# Altium schematic sheet Power_CAN_IO_GPS.SchDoc
size A2
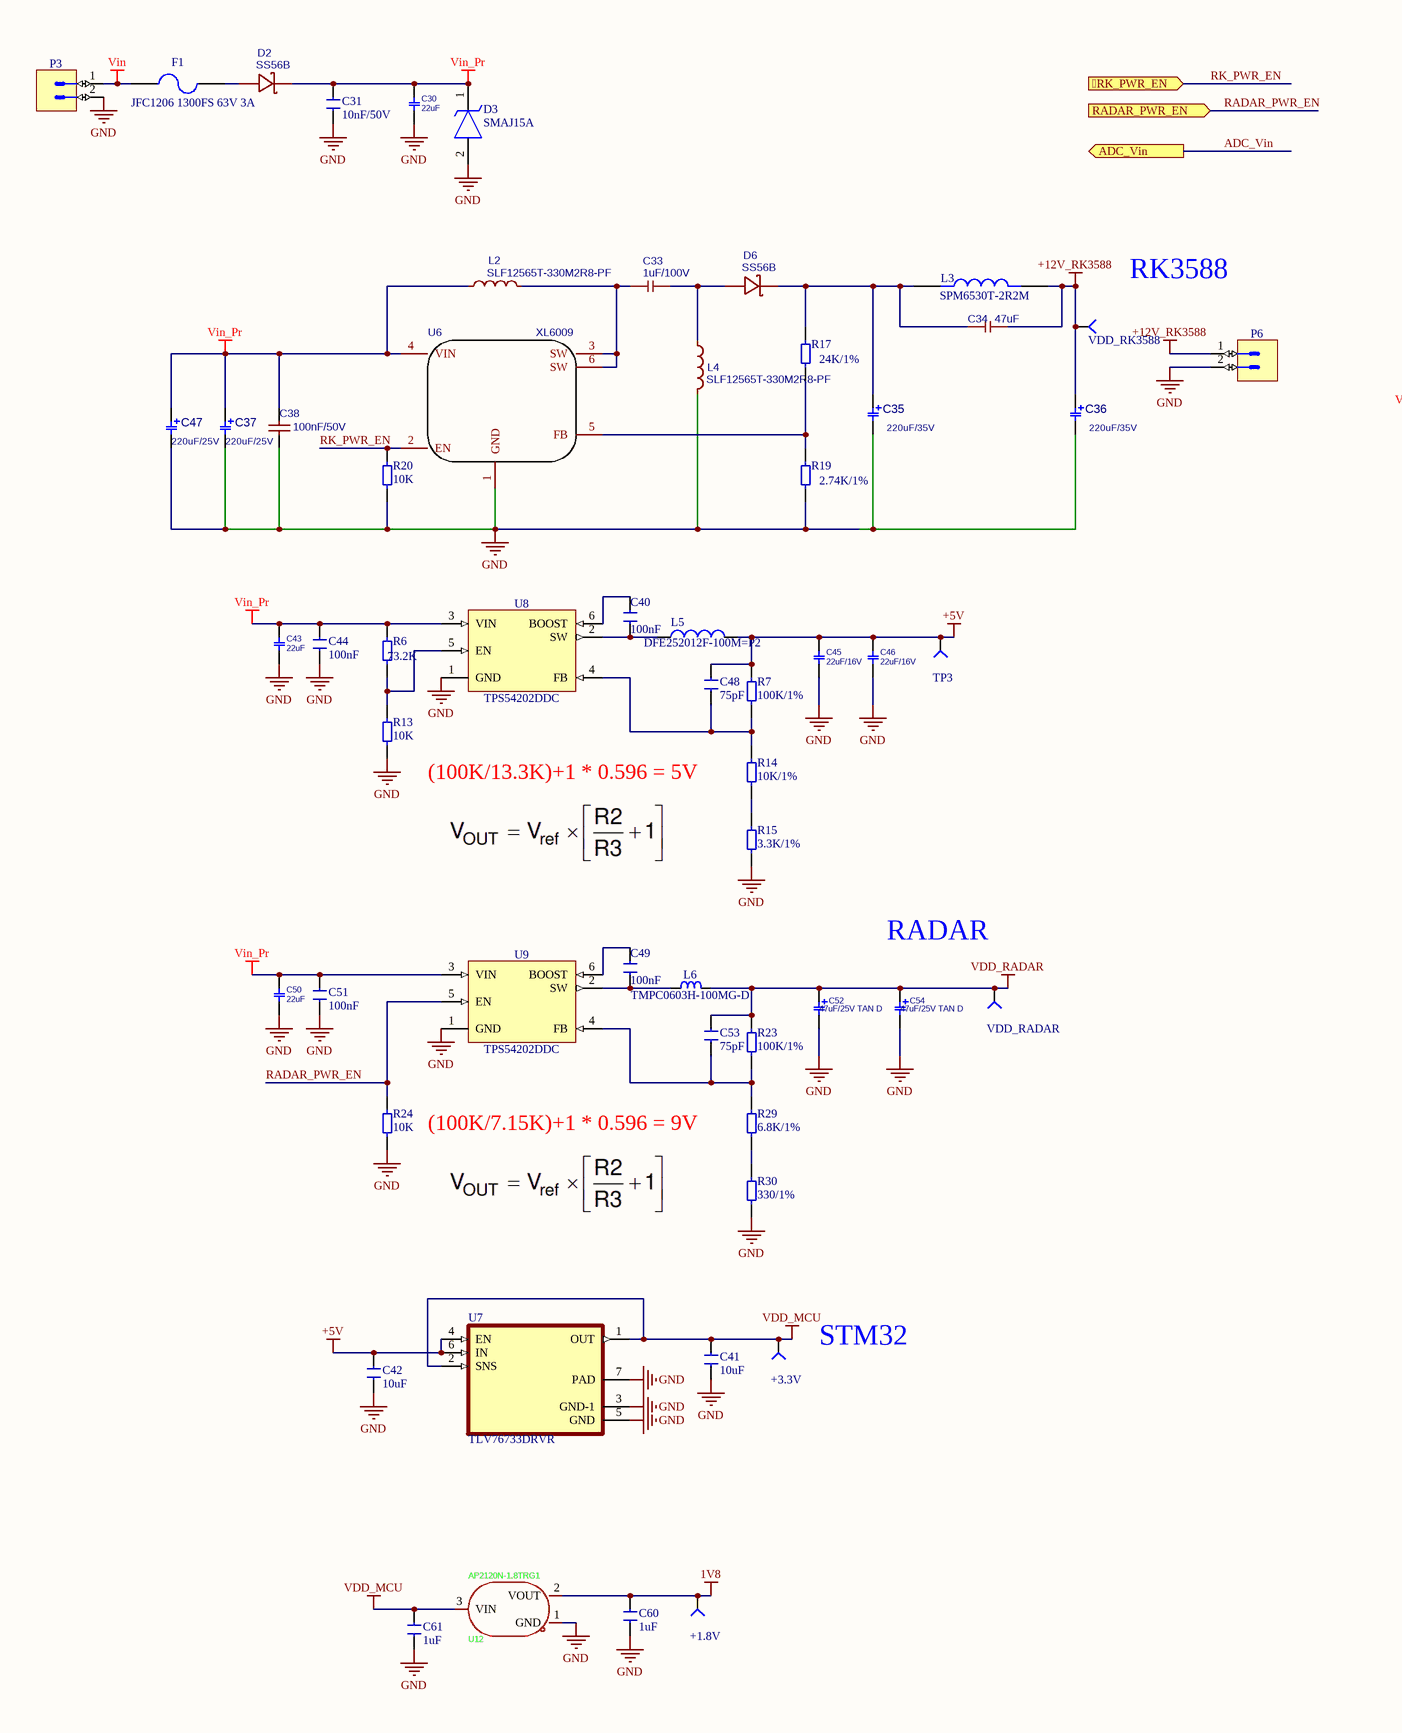
[diagram p0: Power_CAN_IO_GPS.SchDoc, left]
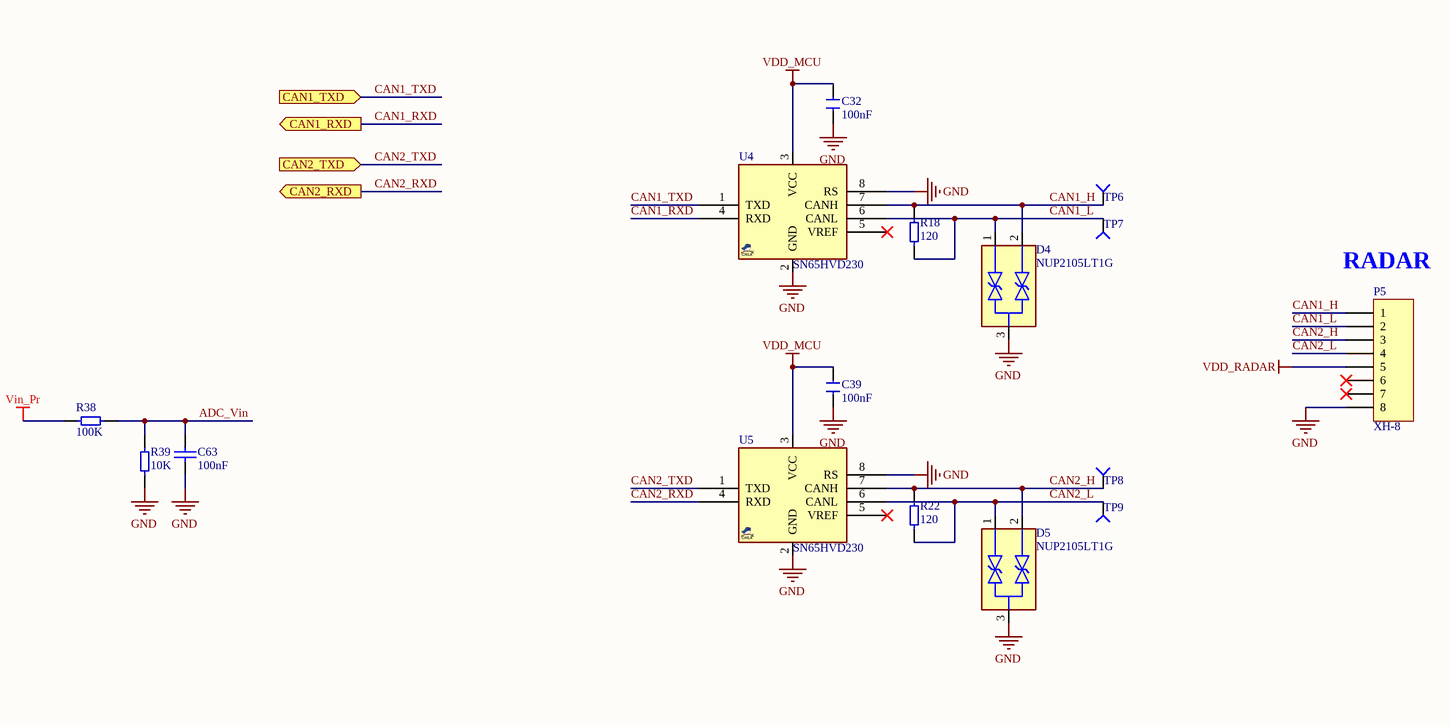
[diagram p1: Power_CAN_IO_GPS.SchDoc, right]

## Parts
+1.8V  TEST POINT  [TEST_POINT]  (value not drawn)  (no BOM)
+3.3V  TEST POINT  [TEST_POINT]  (value not drawn)  (no BOM)
C30  22uF  [C1206E]
C31  10nF/50V  [C0603E]
C32  100nF  [C0603E]
C33  1uF/100V  [C1210]
C34  47uF  [C1210]
C35  220uF/35V  [C_EL_D8L10]
C36  220uF/35V  [C_EL_D8L10]
C37  220uF/25V  [C_EL_D8L10]
C38  100nF/50V  [C0805]
C39  100nF  [C0603E]
C40  100nF  [C0603E]
C41  10uF  [C0603E]
C42  10uF  [C0603E]
C43  22uF  [C1206E]
C44  100nF  [C0603E]
C45  22uF/16V  [C1206E]
C46  22uF/16V  [C1206E]
C47  220uF/25V  [C_EL_D8L10]
C48  75pF  [C0603E]
C49  100nF  [C0603E]
C50  22uF  [C1206E]
C51  100nF  [C0603E]
C52  47uF/25V TAN D  [C_TN_7343]
C53  75pF  [C0603E]
C54  47uF/25V TAN D  [C_TN_7343]
C60  1uF  [C0603E]
C61  1uF  [C0603E]
C63  100nF  [C0603]
D2  SS56B  [SMB_L4.6-W3.6-LS5.3-RD]
D3  SMAJ15A  [DIOM5026X229N]
D4  NUP2105LT1G  [SOT95P237X111-3N]
D5  NUP2105LT1G  [SOT95P237X111-3N]
D6  SS56B  [SMB_L4.6-W3.6-LS5.3-RD]
F1  JFC1206 1300FS 63V 3A  [1206 FUSE]
L2  SLF12565T-330M2R8-PF  [IND-SMD_L12.3-W12.3]
L3  SPM6530T-2R2M  [IND_SPM6530T-2R2M-HZ]
L4  SLF12565T-330M2R8-PF  [IND-SMD_L12.3-W12.3]
L5  DFE252012F-100M=P2  [INDC2520X120N]
L6  TMPC0603H-100MG-D  [IND-SMD_L7.3-W6.6]
P3  KF2EDGV+K-3.81-2P  [PHOENIX_1803426]  (value not drawn)
P5  XH-8  [HDR1X8]
P6  KF2EDGV+K-3.81-2P  [PHOENIX_1803426]  (value not drawn)
R6  73.2K  [R0603E]
R7  100K/1%  [R0603E]
R13  10K  [R0603E]
R14  10K/1%  [R0603E]
R15  3.3K/1%  [R0603E]
R17  24K/1%  [R0603E]
R18  120  [R0603E]
R19  2.74K/1%  [R0603E]
R20  10K  [R0603E]
R22  120  [R0603E]
R23  100K/1%  [R0603E]
R24  10K  [R0603E]
R29  6.8K/1%  [R0603E]
R30  330/1%  [R0603E]
R38  100K  [R0603]
R39  10K  [R0603]
TP3  TEST POINT  [TEST_POINT]  (value not drawn)  (no BOM)
TP6  TEST POINT  [TEST_POINT]  (value not drawn)  (no BOM)
TP7  TEST POINT  [TEST_POINT]  (value not drawn)  (no BOM)
TP8  TEST POINT  [TEST_POINT]  (value not drawn)  (no BOM)
TP9  TEST POINT  [TEST_POINT]  (value not drawn)  (no BOM)
U4  SN65HVD230  [SO_8]
U5  SN65HVD230  [SO_8]
U6  XL6009  [TO-263-5]
U7  TLV76733DRVR  [SON65P200X200X80-7N]
U8  TPS54202DDC  [SOT95P280X100-6N]
U9  TPS54202DDC  [SOT95P280X100-6N]
U12  AP2120N-1.8TRG1  [SOT-23-3_L2.9-W1.3-P1.90-LS2.4-BR]
VDD_RADAR  TEST POINT  [TEST_POINT]  (value not drawn)  (no BOM)
VDD_RK3588  TEST POINT  [TEST_POINT]  (value not drawn)  (no BOM)

## Ports
RK_PWR_EN (in), ADC_Vin (out), CAN1_RXD (out), CAN1_TXD (in), CAN2_RXD (out), CAN2_TXD (in), RADAR_PWR_EN (in)

## Nets
1V8: +1.8V.1(TP) C60.2 U12.2(VOUT)
+5V: C42.2 C45.2 C46.2 C48.2 L5.2 R7.1 TP3.1(TP) U7.4(EN) U7.6(IN)
+12V_RK3588: C34.2 C36.1 L3.2 P6.1 VDD_RK3588.1(TP)
GND: C30.1 C31.1 C32.1 C35.2 C36.2 C37.2 C38.1 C39.1 C41.1 C42.1 C43.1 C44.1 C45.1 C46.1 C47.2 C50.1 C51.1 C52.2 C54.2 C60.1 C61.1 C63.1 D3.2(A) D4.3 D5.3 L4.2 P3.2 P5.8 P6.2 R13.2 R15.2 R19.2 R20.2 R24.2 R30.2 R39.1 U4.2(GND) U4.8(RS) U5.2(GND) U5.8(RS) U6.1(GND) U7.3(GND-1) U7.5(GND) U7.7(PAD) U8.1(GND) U9.1(GND) U12.1(GND)
VDD_MCU: +3.3V.1(TP) C32.2 C39.2 C41.2 C61.2 U4.3(VCC) U5.3(VCC) U7.1(OUT) U7.2(SNS) U12.3(VIN)
VDD_RADAR: C52.1 C53.2 C54.1 L6.2 P5.5 R23.1 VDD_RADAR.1(TP)
Vin: F1.1 P3.1
Vin_Pr: C30.2 C31.2 C37.1 C38.2 C43.2 C44.2 C47.1 C50.2 C51.2 D2.1(K) D3.1(K) L2.1 R6.1 R38.1 U6.4(VIN) U8.3(VIN) U9.3(VIN)
ADC_Vin: C63.2 R38.2 R39.2 ; port ADC_Vin
CAN1_H: D4.2 P5.1 R18.2 TP6.1(TP) U4.7(CANH)
CAN1_L: D4.1 P5.2 R18.1 TP7.1(TP) U4.6(CANL)
CAN1_RXD: U4.4(RXD) ; port CAN1_RXD
CAN1_TXD: U4.1(TXD) ; port CAN1_TXD
CAN2_H: D5.2 P5.3 R22.2 TP8.1(TP) U5.7(CANH)
CAN2_L: D5.1 P5.4 R22.1 TP9.1(TP) U5.6(CANL)
CAN2_RXD: U5.4(RXD) ; port CAN2_RXD
CAN2_TXD: U5.1(TXD) ; port CAN2_TXD
RADAR_PWR_EN: R24.1 U9.5(EN) ; port RADAR_PWR_EN
RK_PWR_EN: R20.1 U6.2(EN) ; port RK_PWR_EN
NetC33_1: C33.1 L2.2 U6.3(SW) U6.6(SW)
NetC33_2: C33.2 D6.2(A) L4.1
NetC34_1: C34.1 C35.1 D6.1(K) L3.1 R17.1
NetC40_1: C40.1 U8.6(BOOST)
NetC40_2: C40.2 L5.1 U8.2(SW)
NetC48_1: C48.1 R7.2 R14.1 U8.4(FB)
NetC49_1: C49.1 U9.6(BOOST)
NetC49_2: C49.2 L6.1 U9.2(SW)
NetC53_1: C53.1 R23.2 R29.1 U9.4(FB)
NetD2_2: D2.2(A) F1.2
NetR6_2: R6.2 R13.1 U8.5(EN)
NetR14_2: R14.2 R15.1
NetR17_2: R17.2 R19.1 U6.5(FB)
NetR29_2: R29.2 R30.1

Not connected (* = marked no-connect by the designer): P5 6* 7*; U4 5(VREF)*; U5 5(VREF)*

## Notes on the sheet
- RK3588
- (near P5) RADAR
- (100K/13.3K)+1 * 0.596 = 5V
- RADAR
- (100K/7.15K)+1 * 0.596 = 9V
- (near +3.3V) STM32

## Library data of the parts
+1.8V +3.3V TP3 TP6-TP9 VDD_RADAR VDD_RK3588 = TEST POINT: Board Qty: 100; PCB Name: Main_PCB
C30 C43 C45 C46 C50 = CAP_SMD_MLCC_22u25V: CAP, MLCC, X5R 22uF 25V 20% 1206; PARAM: X5R, 20%; MANF_P#: TMK316BBJ226ML-T; MANF: Taiyo Yuden; DESC: CAP, MLCC, 22uF, 25V, X5R,  20%, 1206; PARAM2: 25V; PRICE: 0.572$
  C30 C43 C50: VALUE: 22uF
  C45 C46: VALUE: 22uF/16V
C31 C32 C39-C42 C44 C48 C49 C51 C53 C60 C61 = Capacitor SMD
  C31: Value: 10nF/50V
  C32 C39 C40 C44 C49 C51: Value: 100nF
  C41 C42: Value: 10uF
  C48 C53: Value: 75pF
  C60 C61: Value: 1uF
C33 C34 = 47uF: Manufacturer Part: GRM32ER71A476ME15L; catid: 20; spicePre: C
C35 C36 = CAP_SMD_EL_220uF_35v: CAP, SMD, ELEC,; MANF_P#: MANF_PART#; DESC: DESCRIPTION; DIST#: MOUSER; PARAM: 20%; PARAM2: 35v; VALUE: 220uF; PRICE: 10= -$; MANF: MANF; ASSEMBLY: ASSEMBLY
C37 C47 = CAP_SMD_EL_220uF_35v: CAP, SMD, ELEC,; PN: VZH221M1ETR-0810; MANF_P#: MANF_PART#; DESC: DESCRIPTION; DIST#: MOUSER; PARAM: 20%; PARAM2: 35v; VALUE: 220uF; MANF: MANF; ASSEMBLY: ASSEMBLY; Parameter 1: *
C38 = 224: Manufacturer: FH; Manufacturer Part: 0805F224M500NT; nameAlias: Capacitance; Supplier: LCSC; Supplier Part: C41051; JLCPCB Part Class: Extended Part; spicePre: C; spiceSymbolName: 0805F224M500NT_C41051
C52 C54 = CAP_SMD_TAN: CAP, SMD, TAN; PARAM: 20%, 300mOhm, -55~105oC; MANF: VISHAY; MANF_P#: T55A106M6R3C0300; PARAM2: 6.3V; VALUE: -uF; PRICE: 0.46$
C63 = CAP: Value: 100pF; Published: 8-Jun-2000; Revision: July-2002: Re-released for DXP Platform.; Publisher: Altium Limited
D2 D6 = SS54C: 40V 5A Schottky Rectifier; Manufacturer: LGE(鲁光); Manufacturer Part: SS54; Contributor: LCSC; Supplier: LCSC; Supplier Part: C330398; JLCPCB Part Class: Extended Part; spicePre: D; spiceSymbolName: SS54C
D3 = SMAJ24A: TVS Diode (Uni-directional); Manufacturer_Name: LITTELFUSE; Datasheet Link: https://componentsearchengine.com/Datasheets/2/SMAJ24A.pdf; Height: 2.29mm; Manufacturer_Part_Number: SMAJ24A; Mouser Part Number: 576-SMAJ24A; Mouser Price/Stock: https://www.mouser.co.uk/ProductDetail/Littelfuse/SMAJ24A?qs=HR2RnyOI4E78ZevQKM2hdA%3D%3D; Arrow Part Number: SMAJ24A; Arrow Price/Stock: https://www.arrow.com/en/products/smaj24a/littelfuse?region=nac
D4 D5 = NUP2105LT1G: Dual Bi-Directional TVS Diode 350W 3-Pin SOT-23 | ON Semiconductor NUP2105LT1G; SnapEDA_Link: https://www.snapeda.com/parts/NUP2105LT1G/Onsemi/view-part/?ref=snap; Package: SOT-23-3 ON Semiconductor; Value: *; MF: ON Semiconductor; MP: NUP2105LT1G; Check_prices: https://www.snapeda.com/parts/NUP2105LT1G/Onsemi/view-part/?ref=eda
F1 = Fuse SMD1206: Fuse Type Fast Acting with 63V, 3A, 1206; Designer: Abbas Basereh; Desc.: SMD Fuses 1206; Data: 16-12-2016
L2 L4 = 33uH: Manufacturer: SHOU HAN(首韩); Manufacturer Part: CYH125-33UH; nameAlias: Inductance; Contributor: lcsc; Supplier: LCSC; Supplier Part: C2879698; JLCPCB Part Class: Extended Part; spicePre: L; spiceSymbolName: CYH125-33UH
L3 = SPM6530T-2R2M-HZ: MF: {'manufacturer': u'TDK Corporation'}; Package: None; MP: SPM6530T-2R2M-HZ; Value: *; Availability: Unavailable; Price: None
L5 = DFE252012F-100M=P2: Inductor with Inductance: 10uH Tol. +/-20%, Package: 1008 (2520); MF: Murata Electronics; SnapEDA_Link: https://www.snapeda.com/parts/DFE252012F-100M=P2/Murata%20Electronics%20North%20America/view-part/1498782/?ref=snap; Value: *; Digi-Key_Part_Number: 490-13050-1-ND; Mouser-Purchase-URL: https://snapeda.com/shop?store=Mouser&id=1498782; MP: DFE252012F-100M=P2; DigiKey-Purchase-URL: https://snapeda.com/shop?store=DigiKey&id=1498782; Package: 2520 Murata; Check_prices: https://www.snapeda.com/parts/DFE252012F-100M=P2/Murata%20Electronics%20North%20America/view-part/1498782/?ref=eda
L6 = IND1008_1UH_20%_WURTH_74479787210B: Inductor; Part Description: Power Multilayer Inductor (WE-PMI Series); Manufacturer: WURTH ELEKTRONIK; Power: 1.95A; Resistance: 0.06R; Tolerance: ±20%; Part Number: IND1008_1UH_20%_WURTH_74479787210B; Component Kind: Standard; Component Type: Standard; Footprint: INDC2620X100N; Pin Count: 2; Value: TMPC0603H-100MG-D; Manufacturer Part Number: 74479787210B; Case: 1008; Mounted: Yes; Socket: No; SMD: Yes; Sense: No; ComponentHeight: 1mm; HelpURL: \\cern.ch\dfs\Applications\Altium\Datasheets\IND_WURTH_WE-PMI_74479787210B.pdf; Author: CERN DEM JLC; CreateDate: 10/1/2014; LatestRevisionDate: 10/1/2014
P3 P6 = PHOENIX_1803426: Connector 2 Male; Part Description: 8A 160 V, Pitch: 3.81mm, 2 Positions Header; Manufacturer: PHOENIX CONTACT; Manufacturer Part Number: 1803426 (MCV 1,5/2-G-3,81); PressFit: No; Part Number: PHOENIX_1803426; Component Kind: Standard; Component Type: Standard; Pin Count: 2; Mounted: Yes; Socket: No; SMD: No; Sense: No; Status: None; ComponentHeight: 9.2mm; HelpURL: \\cern.ch\dfs\Applications\Altium\Datasheets\PHOENIX_1803426.pdf; Author: CERN DEM JLC; CreateDate: 5/4/2010; LatestRevisionDate: 5/4/2010
P5 = Header 8: Header, 8-Pin; LatestRevisionDate: 17-Jul-2002; LatestRevisionNote: Re-released for DXP Platform.; Publisher: Altium Limited
R6 R7 R13-R15 R18 R20 R22-R24 R29 R30 R38 R39 = Resistor SMD
  R6: Value: 73.2K
  R7 R23: Value: 100K/1%
  R13 R20 R24 R39: Value: 10K
  R14: Value: 10K/1%
  R15: Value: 3.3K/1%
  R18 R22: Value: 120
  R29: Value: 6.8K/1%
  R30: Value: 330/1%
  R38: Value: 100K
R17 R19 = Resistor SMD: Value: 100K
U4 U5 = SN65HVD230_SOP8: CAN,  Transceivers, 3.3V (VDD); MANF: Texas Instruments; MANF_P#: SN65HVD230D, SN65HVD230QD; PARAM: -40~85oC; PRICE: 2.3$@MOUSER; PARAM2: 3.3V (VDD); VALUE: SN65HVD230
U6 = XL6009: Manufacturer: XLSEMI; sourceId: BD9FzR93l; Contributor: GerryChen; Supplier: LCSC; Manufacturer Part: XL6009; spicePre: U; Supplier Part: C15831
U7 = TLV76733DRVR: Adjustable- and fixed-output, 1-A, 16-V, positive-voltage low-dropout (LDO) linear regulator; MF: Texas Instruments; SnapEDA_Link: https://www.snapeda.com/parts/TLV76733DRVR/Texas+Instruments/view-part/?ref=snap; Package: WSON-6 Texas Instruments; Value: *; MP: TLV76733DRVR; Check_prices: https://www.snapeda.com/parts/TLV76733DRVR/Texas+Instruments/view-part/?ref=eda
U8 U9 = TPS54202DDC: 4.5V to 28V Input, 2-A Output, EMI Friendly / Synchronous Step Down Converter; Part Description: 4.5V to 28V Input, 2A Output, EMI Friendly Synchronous Step Down Converter; Manufacturer: TEXAS INSTRUMENTS; PressFit: No; Bonding: No; Part Number: TPS54202DDC; Component Kind: Standard; Component Type: Standard; Device: TPS54202DDC; PackageDescription: SOT23, 0.95mm Pitch; 6 Pin, 1.625mm W X 2.90mm L X 1.00mm H body, IPC Medium Density; Manufacturer Part Number: TPS54202DDC; Pin Count: 5; Case: SOT23-6; Mounted: Yes; Socket: No; SMD: Yes; Sense: No; ComponentHeight: 1.1mm; HelpURL: \\cern.ch\dfs\Applications\Altium\Datasheets\TPS54202.pdf; Author: CERN DEM HF; CreateDate: 6/10/2022; LatestRevisionDate: 6/10/2022
U12 = AP2120N-3.3TRG1: Manufacturer: DIODES(美台); Add into BOM: yes; Maximum Input Voltage: 6V; Output Voltage: 3.3V; MAX Output Current: 150mA; Power Supply Rejection Ratio (PSRR): 65dB@(1kHz); Dropout Voltage: 500mV@(150mA); standby current: 50uA; Output Polarity: Positive electrode; Number of Outputs: 1; Symbol: AP2120N-3.3TRG1; Device: AP2120N-3.3TRG1; LCSC Part Name: 输入6V 输出3.3V 150mA; Supplier Part: C156330; Manufacturer Part: AP2120N-3.3TRG1; Supplier Footprint: SOT-23; JLCPCB Part Class: Extended Part; Datasheet: https://atta.szlcsc.com/upload/public/pdf/source/20180307/C156330_15204110207831407988.pdf; Supplier: LCSC; Convert to PCB: yes; Operating Temperature: -40℃~+85℃